# Altium schematic sheet 实验.SchDoc
size A4
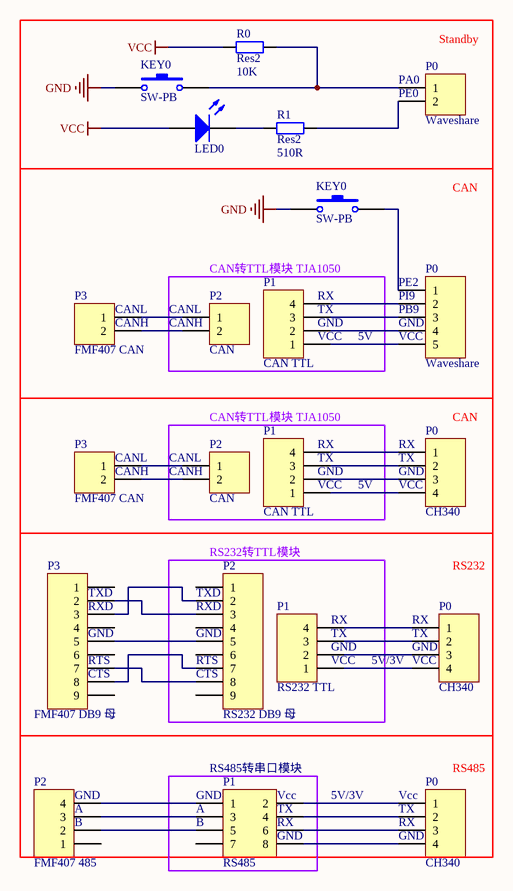
[diagram p0: 实验.SchDoc]

## Parts
(Parts that share a designator on the sheet are numbered #1, #2 ... from top to bottom, then left to right.)
?  LED0  [LED-0]
KEY0#1  SW-PB  [SPST-2]
KEY0#2  SW-PB  [SPST-2]
P0#1  Waveshare  [HDR1X2]
P0#2  Waveshare  [HDR1X5]
P0#3  CH340  [HDR1X4]
P0#4  CH340  [HDR1X4]
P0#5  CH340  [HDR1X4]
P1#1  CAN TTL  [HDR1X4]
P1#2  CAN TTL  [HDR1X4]
P1#3  RS232 TTL  [HDR1X4]
P1#4  RS485  [HDR2X4]
P2#1  CAN  [HDR1X2]
P2#2  CAN  [HDR1X2]
P2#3  RS232 DB9 母  [HDR1X9]
P2#4  FMF407 485  [HDR1X4]
P3#1  FMF407 CAN  [HDR1X2]
P3#2  FMF407 CAN  [HDR1X2]
P3#3  FMF407 DB9 母  [HDR1X9]
R0  Res2  value 10K  [AXIAL-0.4]
R1  Res2  value 510R  [AXIAL-0.4]

## Nets
GND: KEY0#1.1 KEY0#2.1
VCC: ?.1(A) R0.1
Net?_2: ?.2(K) R1.1
NetKEY0#1_2: KEY0#1.2 P0#1.1 R0.2
NetKEY0#2_2: KEY0#2.2 P0#2.1
NetP0#1_2: P0#1.2 R1.2
NetP0#2_2: P0#2.2 P1#1.4
NetP0#2_3: P0#2.3 P1#1.3
NetP0#2_4: P0#2.4 P1#1.2
NetP0#2_5: P0#2.5 P1#1.1
NetP0#3_1: P0#3.1 P1#2.4
NetP0#3_2: P0#3.2 P1#2.3
NetP0#3_3: P0#3.3 P1#2.2
NetP0#3_4: P0#3.4 P1#2.1
NetP0#4_1: P0#4.1 P1#3.4
NetP0#4_2: P0#4.2 P1#3.3
NetP0#4_3: P0#4.3 P1#3.2
NetP0#4_4: P0#4.4 P1#3.1
NetP0#5_1: P0#5.1 P1#4.2
NetP0#5_2: P0#5.2 P1#4.4
NetP0#5_3: P0#5.3 P1#4.6
NetP0#5_4: P0#5.4 P1#4.8
NetP1#4_1: P1#4.1 P2#4.4
NetP1#4_3: P1#4.3 P2#4.3
NetP1#4_5: P1#4.5 P2#4.2
NetP2#1_1: P2#1.1 P3#1.1
NetP2#1_2: P2#1.2 P3#1.2
NetP2#2_1: P2#2.1 P3#2.1
NetP2#2_2: P2#2.2 P3#2.2
NetP2#3_2: P2#3.2 P3#3.3
NetP2#3_3: P2#3.3 P3#3.2
NetP2#3_5: P2#3.5 P3#3.5
NetP2#3_7: P2#3.7 P3#3.8
NetP2#3_8: P2#3.8 P3#3.7

Not connected (* = marked no-connect by the designer): P1#4 7; P2#3 1 4 6 9; P2#4 1; P3#3 1 4 6 9

## Notes on the sheet
- (near P0#1) PE0
- (near P0#1) PA0
- (near P0#1) Standby
- CAN
- CAN转TTL模块 TJA1050
- (near P1#1) RX
- (near P0#2) PI9
- (near P0#2) PE2
- (near P3#1) CANL
- (near P3#1) CANH
- (near P2#1) CANL
- (near P2#1) CANH
- (near P1#1) TX
- (near P1#1) GND
- (near P1#1) VCC
- 5V
- (near P0#2) PB9
- (near P0#2) GND
- (near P0#2) VCC
- (near P0#3) CAN
- (near P3#2) CANL
- (near P3#2) CANH
- (near P2#2) CANL
- (near P2#2) CANH
- (near P1#2) RX
- (near P1#2) TX
- (near P1#2) GND
- (near P1#2) VCC
- (near P0#3) RX
- (near P0#3) TX
- (near P0#3) GND
- (near P0#3) VCC
- (near P2#3) RS232转TTL模块
- RS232
- (near P3#3) GND
- (near P3#3) RXD
- (near P3#3) TXD
- (near P2#3) GND
- (near P2#3) TXD
- (near P2#3) RXD
- (near P1#3) RX
- (near P1#3) TX
- (near P0#4) RX
- (near P0#4) TX
- (near P3#3) RTS
- (near P3#3) CTS
- (near P2#3) RTS
- (near P2#3) CTS
- (near P1#3) GND
- (near P1#3) VCC
- 5V/3V
- (near P0#4) GND
- (near P0#4) VCC
- (near P1#4) RS485转串口模块
- (near P0#5) RS485
- (near P2#4) A
- (near P2#4) B
- (near P2#4) GND
- (near P1#4) A
- (near P1#4) B
- (near P1#4) GND
- (near P1#4) Vcc
- (near P1#4) TX
- (near P1#4) RX
- (near P0#5) TX
- (near P0#5) RX
- (near P0#5) GND
- (near P0#5) Vcc

## Library data of the parts
? = LED0: Typical INFRARED GaAs LED; Published: 8-Jun-2000; LatestRevisionDate: 08-Jul-2005; LatestRevisionNote: Mech Layer 1 removed.; PackageReference: LED-0; Publisher: Altium Limited; PackageDescription: LED; 2 Leads
KEY0#1 KEY0#2 = SW-PB: Switch; Published: 24-Mar-1999; LatestRevisionDate: 17-Jul-2002; LatestRevisionNote: Re-released for DXP Platform.; PackageReference: SPST-2; Publisher: Altium Limited; PackageDescription: Switch; 2 Leads
P0#1 P2#1 P2#2 P3#1 P3#2 = Header 2: Header, 2-Pin; LatestRevisionDate: 17-Jul-2002; LatestRevisionNote: Re-released for DXP Platform.; Publisher: Altium Limited
P0#2 = Header 5: Header, 5-Pin; LatestRevisionDate: 17-Jul-2002; LatestRevisionNote: Re-released for DXP Platform.; Publisher: Altium Limited
P0#3-P0#5 P1#1-P1#3 P2#4 = Header 4: Header, 4-Pin; LatestRevisionDate: 17-Jul-2002; LatestRevisionNote: Re-released for DXP Platform.; Publisher: Altium Limited
P1#4 = Header 4X2: Header, 4-Pin, Dual row; LatestRevisionDate: 17-Jul-2002; LatestRevisionNote: Re-released for DXP Platform.; Publisher: Altium Limited
P2#3 P3#3 = Header 9: Header, 9-Pin; LatestRevisionDate: 17-Jul-2002; LatestRevisionNote: Re-released for DXP Platform.; Publisher: Altium Limited
R0 R1 = Res2: Resistor; Published: 8-Jun-2000; LatestRevisionDate: 17-Jul-2002; LatestRevisionNote: Re-released for DXP Platform.; PackageReference: AXIAL-0.4; Publisher: Altium Limited; PackageDescription: Axial Device, Thru-Hole; 2 Leads; 0.4 in Pin Spacing